# Altium schematic sheet ps2m_toplevel.SchDoc
size A4
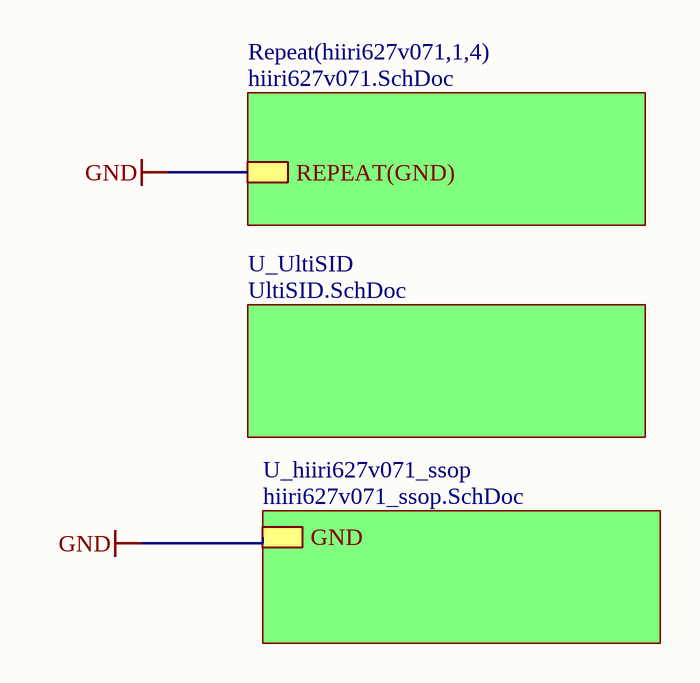
[diagram p0: ps2m_toplevel.SchDoc]

## Sub-sheets
Repeat(hiiri627v071,1,4) = hiiri627v071.SchDoc: REPEAT(GND)
U_hiiri627v071_ssop = hiiri627v071_ssop.SchDoc: GND
U_UltiSID = UltiSID.SchDoc: no entries

## Nets
GND: sheet Repeat(hiiri627v071,1,4)/REPEAT(GND), sheet U_hiiri627v071_ssop/GND